# EAGLE design Sim_Breakout (EAGLE 6.5.0)
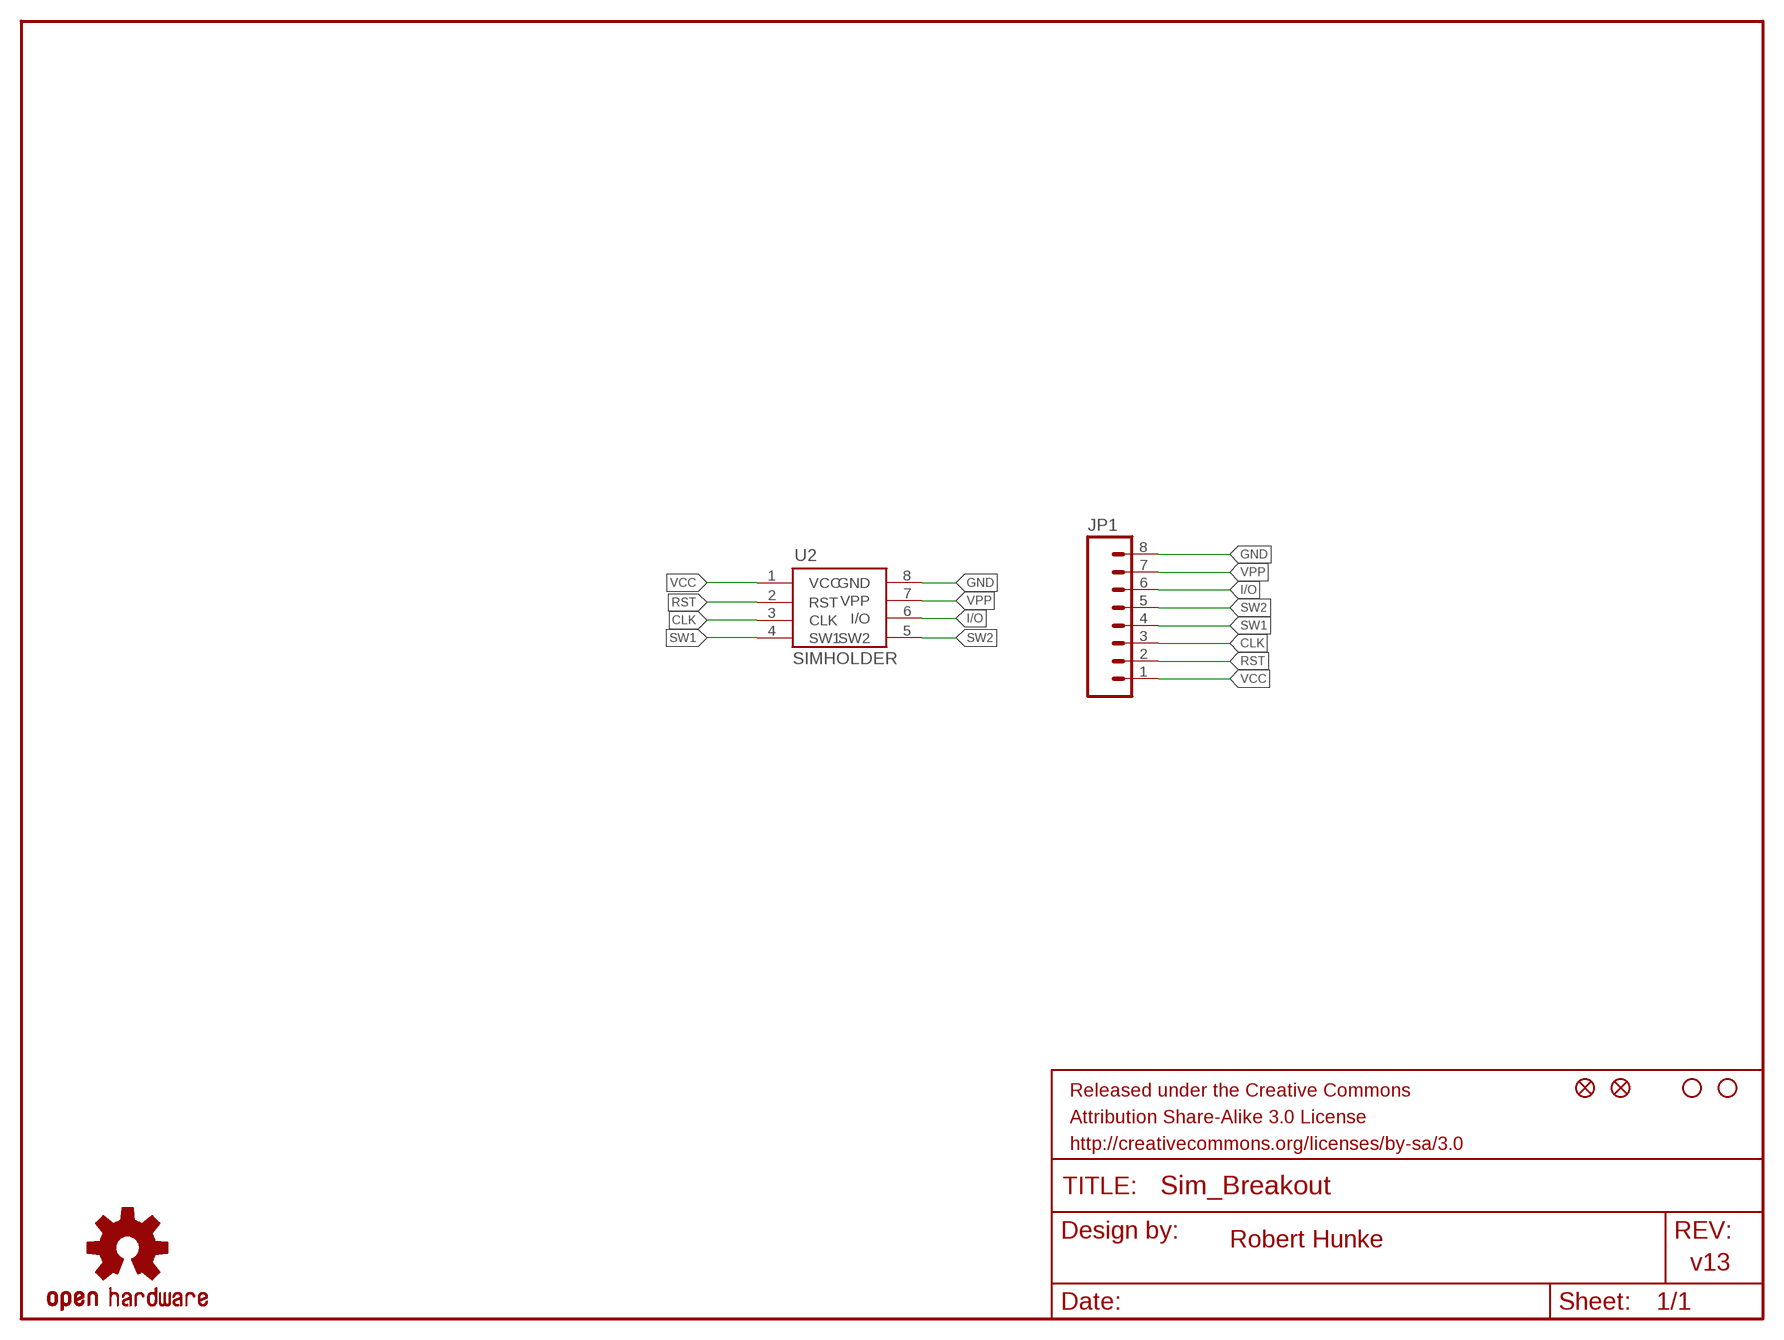
[diagram p0: schematic, sheet 1]

## Parts
FID1  FIDUCIALUFIDUCIAL  [MICRO-FIDUCIAL]
FID2  FIDUCIALUFIDUCIAL  [MICRO-FIDUCIAL]
FRAME2  FRAME-LETTER  [CREATIVE_COMMONS]
JP1  M08  [1X08]
LOGO1  OSHW-LOGOS  [OSHW-LOGO-S]
STANDOFF1  STAND-OFF  [STAND-OFF]
STANDOFF2  STAND-OFF  [STAND-OFF]
U2  SIMHOLDER  SIMHOLDER2  [SIMHOLDER2]

## Nets
CLK: JP1.3 U2.3(CLK)
GND: JP1.8 U2.8(GND)
I/O: JP1.6 U2.6(I/O)
RST: JP1.2 U2.2(RST)
SW1: JP1.4 U2.4(SW1)
SW2: JP1.5 U2.5(SW2)
VCC: JP1.1 U2.1(VCC)
VPP: JP1.7 U2.7(VPP)

## Notes on the sheet
- Robert Hunke
- v13

## Library data of the parts
FID1 FID2 = SparkFun-Aesthetics:FIDUCIAL: Fiducial Alignment Points Various fiducial points for machine vision alignment.
FRAME2 = SparkFun-Aesthetics:FRAME-LETTER: Schematic Frame Standard 8.5x11 US Letter frame
JP1 = SparkFun:M08: Header 8 Standard 8-pin 0.1" header. Use with straight break away headers (SKU : PRT-00116), right angle break away headers (PRT-00553), swiss pins (PRT-00743), machine pins (PRT-00117), and female headers (PRT-00115).
LOGO1 = SparkFun-Aesthetics:OSHW-LOGO: Open Source Hardware Logo This logo indicates the piece of hardware it is found on incorporates a OSHW license and/or adheres to the definition of open source hardware found here: http://freedomdefined.org/OSHW
STANDOFF1 STANDOFF2 = SparkFun-Electromechanical:STAND-OFF: #4 Stand Off This is the mechanical footprint for a #4 phillips button head screw. Use the keepout ring to avoid running the screw head into surrounding components. SKU : PRT-00447
U2 = SparkFun:SIMHOLDER2

## Board
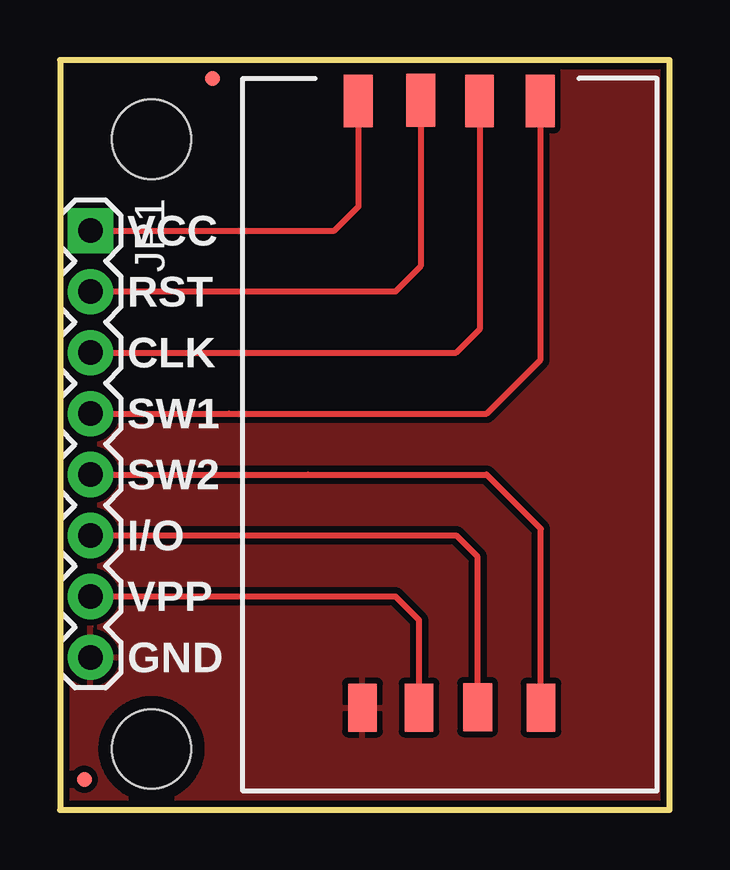
[diagram p1: board, top side]
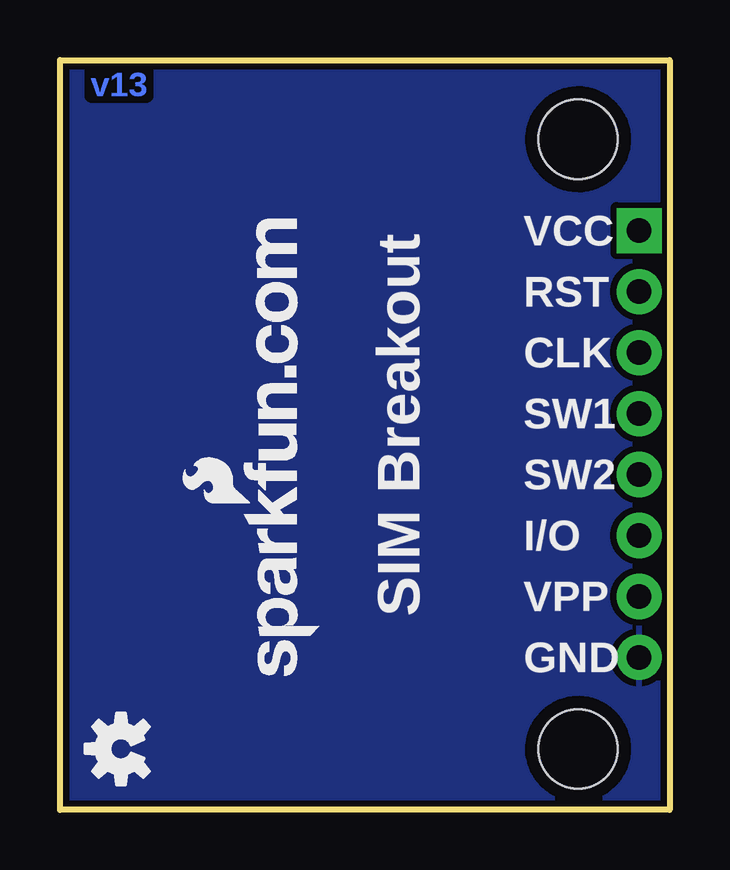
[diagram p2: board, bottom side, seen from below]

Size 25.4 x 31.24 mm. Coordinates in mm from the lower left corner, seen from the top.
Outline: 0,0 25.4,0 25.4,31.24 0,31.24 0,0
Copper layers (1*16): Top 0.035mm / dielectric 1.5mm / Bottom 0.035mm
Design rules "SparkFun": minimum track width 8mil, minimum drill 20mil, track to track 8mil, track to pad 8mil, pad to pad 8mil, via to via 8mil, smd to smd 8mil, copper to edge 8mil, drill to drill 8mil, minimum pad ring 12mil, minimum via ring 10mil, stop-mask expansion 4mil, vias tented up to drill 20mil, thermal gap 10mil

### Footprints (pad centres in the part's own frame; a part is rotated, then mirrored left to right if it is on the bottom)
MICRO-FIDUCIAL = smd 0.635 x 0.635: 1 0,0
1X08 = drill 1.016 pad 1.88 square: 1 0,0 | drill 1.016 pad 1.88: 2 2.54,0; 3 5.08,0; 4 7.62,0; 5 10.16,0; 6 12.7,0; 7 15.24,0; 8 17.78,0
STAND-OFF = hole 3.302: 0,0
SIMHOLDER2 = smd 2.2 x 1.2: 1 0.95,4.81; 2 0.91,7.41; 3 0.95,9.86; 4 0.95,12.39 | smd 2 x 1.2: 5 26.22,12.42; 6 26.2,9.78; 7 26.22,7.34; 8 26.22,4.98

### Placement (x,y rotation side)
FID1  1.02,1.27 0 top
FID2  6.35,30.48 0 top
FRAME2  -19.05,-10.16 0 top  (outside the outline)
JP1  1.27,24.13 270 top
LOGO1  22.86,2.54 90 bottom
STANDOFF1  3.81,27.94 0 top
STANDOFF2  3.81,2.54 0 top
U2  7.62,30.48 270 top
U$1  [SFE-NEW-WEBLOGO]  14.61,5.59 90 bottom

### Tracks (layer width: path | path; a pad name or v marks a point on that pad's centre or on a via)
CLK
  Top 0.254: U2.3 17.48,20.02 16.51,19.05 JP1.3
GND
  Top 0.254: U2.8 12.7,4.16 12.7,3.81
  pour Bottom (isolate 0.254): 0,0 0,31.24 25.4,31.24 25.4,0
  pour Top (isolate 0.254): 0,0 0,31.24 25.4,31.24 25.4,0
I/O
  Top 0.254: JP1.6 16.51,11.43 17.4,10.54 U2.6
RST
  Top 0.254: U2.2 15.03,22.65 13.97,21.59 JP1.2
SW1
  Top 0.254: JP1.4 7.05,16.51 17.78,16.51 20.01,18.74 U2.4
SW2
  Top 0.254: JP1.5 10.33,13.97 17.78,13.97 20.04,11.71 U2.5
VCC
  Top 0.254: JP1.1 11.43,24.13 12.43,25.13 U2.1
VPP
  Top 0.254: JP1.7 13.97,8.89 14.96,7.9 U2.7

### Text on the board
Bottom: v13
tPlace: VCC | RST | CLK | SW1 | SW2 | I/O | VPP | GND
bPlace: SIM Breakout | VCC | RST | CLK | SW1 | SW2 | I/O | VPP | GND
tValues: SIM Socket hinge this end | No leads soldered to these pads | SIM Socket Opening this end
tDocu: Robert Hunke